# Altium project PoESP_ConnectorBoard.PrjPcb
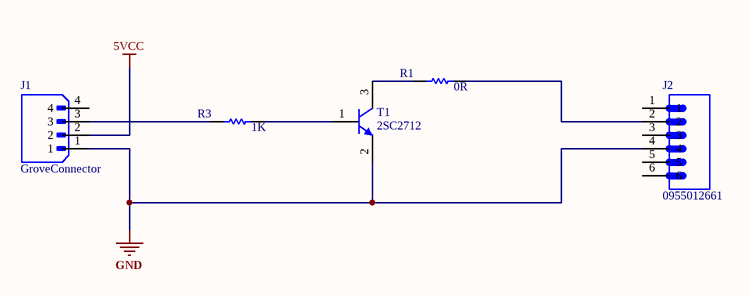
[diagram p0: PoESP_ConnectorBoard.SchDoc]
1 sheet, 5 parts. Net scope: global (net labels, ports and power ports of the same name join across sheets).
Board file: PoESP_ConnectorBoard.PcbDoc

## Sheet PoESP_ConnectorBoard.SchDoc
size A4; SheetNumber: 1; SheetTotal: 1

### Parts
J1  GroveConnector  [SEEEDSTUDIO_114020164]
J2  0955012661  [MOLEX_0955012661]
R1  0R  [RES-0603]
R3  1K  [RES-0603]
T1  value 2SC2712  [SOT23-3D]  (hidden comment: 9013-SOT23)

### Nets
5VCC: J1.2
GND: J1.1 J2.4 T1.2(E)
NetJ1_3: J1.3 R3.1
NetJ2_2: J2.2 R1.2
NetR1_1: R1.1 T1.3(C)
NetR3_2: R3.2 T1.1(B)

Not connected (* = marked no-connect by the designer): J1 4; J2 1 3 5 6

### Notes on the sheet
- Project Manager
- Date:
- Designer
- Checked by
- Title
- Product
- Number:
- Rev:
- File:

### Library data of the parts
J1 = 114020164: GROVE FEMALE HEADER R/A 20PACK; MF: Seeed Technology Co., Ltd; SnapEDA_Link: https://www.snapeda.com/parts/114020164/Seeed+Technology+Co.%252C+Ltd/view-part/?ref=snap; Package: None; Value: *; MP: 114020164; Check_prices: https://www.snapeda.com/parts/114020164/Seeed+Technology+Co.%252C+Ltd/view-part/?ref=eda
J2 = 0955012661: Jack Modular Connector 6p6c (RJ11, RJ12, RJ14, RJ25) 90Â° Angle (Right) Unshielded Cat3; MF: Molex; Value: *; Package: None; Check_prices: https://www.snapeda.com/parts/0955012661/Molex/view-part/881426/?ref=eda; SnapEDA_Link: https://www.snapeda.com/parts/0955012661/Molex/view-part/881426/?ref=snap; Price: None; Availability: Unavailable; MP: 0955012661
R1 R3 = RES: LCSC Part NO: *; Manufacturer: *; Manufacturer Part Number: *; Package: *; Value: *; Digikey Part Number: *; Mouser Part Number: *
T1 = NPN-SOT23: NPN Bipolar Transistor; Manufacturer_Part_Number: BSR14; Manufacturer: ON SEMICONDUCTOR; Revision: *; ComponentLink1Description: Datasheet; ComponentLink1URL: http://tunmcdsvn.tun.st.com/Component_Datasheet_Library/Trunk/IC/NXP_Transistor_BSR14; Package: SOT23